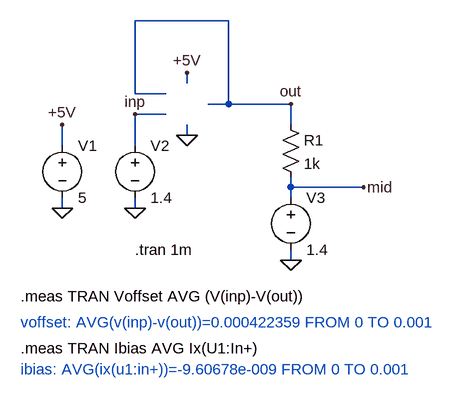
[diagram p0: schematic 03-LM358 ti offset voltage bias current.asc]
03-LM358 ti offset voltage bias current.asc, the LTspice schematic file:
Version 4
SHEET 1 880 680
WIRE 112 16 -32 16
WIRE 48 112 48 96
WIRE -32 128 -32 16
WIRE 16 128 -32 128
WIRE 112 144 112 16
WIRE 112 144 80 144
WIRE 208 144 112 144
WIRE 16 160 -32 160
WIRE 208 176 208 144
WIRE 48 192 48 176
WIRE -144 208 -144 176
WIRE -32 208 -32 160
WIRE 208 272 208 256
WIRE 320 272 208 272
WIRE 208 288 208 272
WIRE -144 304 -144 288
WIRE -32 304 -32 288
WIRE 208 384 208 368
FLAG 48 192 0
FLAG -144 304 0
FLAG -144 176 +5V
FLAG 48 96 +5V
FLAG -32 304 0
FLAG 208 384 0
FLAG 208 144 out
FLAG -32 160 inp
FLAG 320 272 mid
SYMBOL voltage -144 192 R0
WINDOW 123 0 0 Left 0
WINDOW 39 0 0 Left 0
SYMATTR InstName V1
SYMATTR Value 5
SYMBOL voltage -32 192 R0
WINDOW 123 0 0 Left 0
WINDOW 39 0 0 Left 0
SYMATTR InstName V2
SYMATTR Value 1.4
SYMBOL res 192 160 R0
SYMATTR InstName R1
SYMATTR Value 1k
SYMBOL voltage 208 272 R0
WINDOW 123 0 0 Left 0
WINDOW 39 0 0 Left 0
SYMATTR InstName V3
SYMATTR Value 1.4
TEXT -32 368 Left 2 !.tran 1m
TEXT -208 440 Left 2 !.meas TRAN Voffset AVG (V(inp)-V(out))
TEXT -208 480 Left 2 ;voffset: AVG(v(inp)-v(out))=0.000422359 FROM 0 TO 0.001
TEXT -208 520 Left 2 !.meas TRAN Ibias AVG Ix(U1:In+)
TEXT -208 552 Left 2 ;ibias: AVG(ix(u1:in+))=-9.60678e-009 FROM 0 TO 0.001

The netlist it stands for:
* 03-LM358 ti offset voltage bias current.asc
V1 +5V 0 5
V2 inp 0 1.4
R1 out mid 1k
V3 mid 0 1.4
.tran 1m
.meas TRAN Voffset AVG (V(inp)-V(out))
* voffset: AVG(v(inp)-v(out))=0.000422359 FROM 0 TO 0.001
.meas TRAN Ibias AVG Ix(U1:In+)
* ibias: AVG(ix(u1:in+))=-9.60678e-009 FROM 0 TO 0.001
.backanno
.end

* Results of the author's LTspice run, read from the files saved beside the schematic
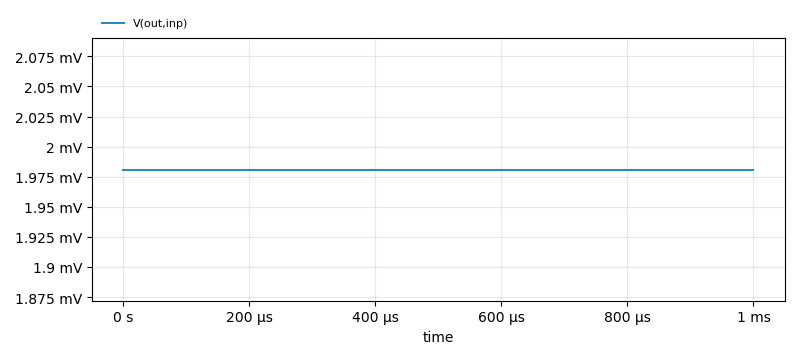
[diagram p1: Transient Analysis of 03-LM358 ti offset voltage bias current.asc, plotted from the saved traces]
* Transient Analysis, 1 run:
*   V(out,inp): min 1.981 mV, max 1.981 mV, average 1.981 mV, rms 1.981 mV, last 1.981 mV
* From the log:
*   voffset: AVG(v(inp)-v(out))=-0.0019809 FROM 0 TO 0.001
*   Measurement "ibias" FAIL'ed